# EAGLE design CrackberryPi_1.0.6.2_random (EAGLE 7.2.0)
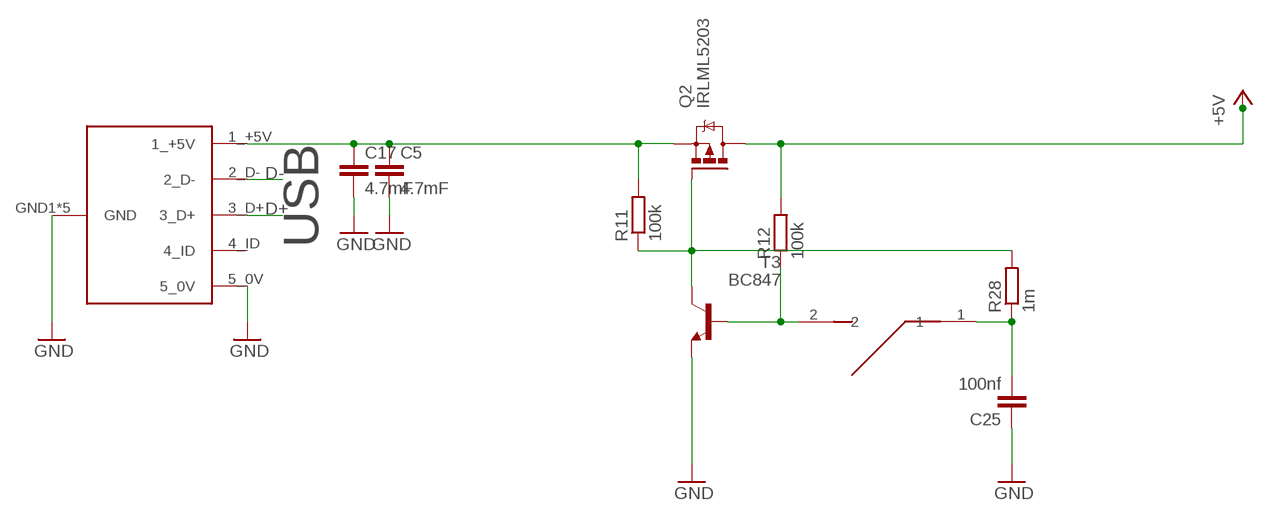
[diagram p0: schematic, sheet 1, part 1 of 2]
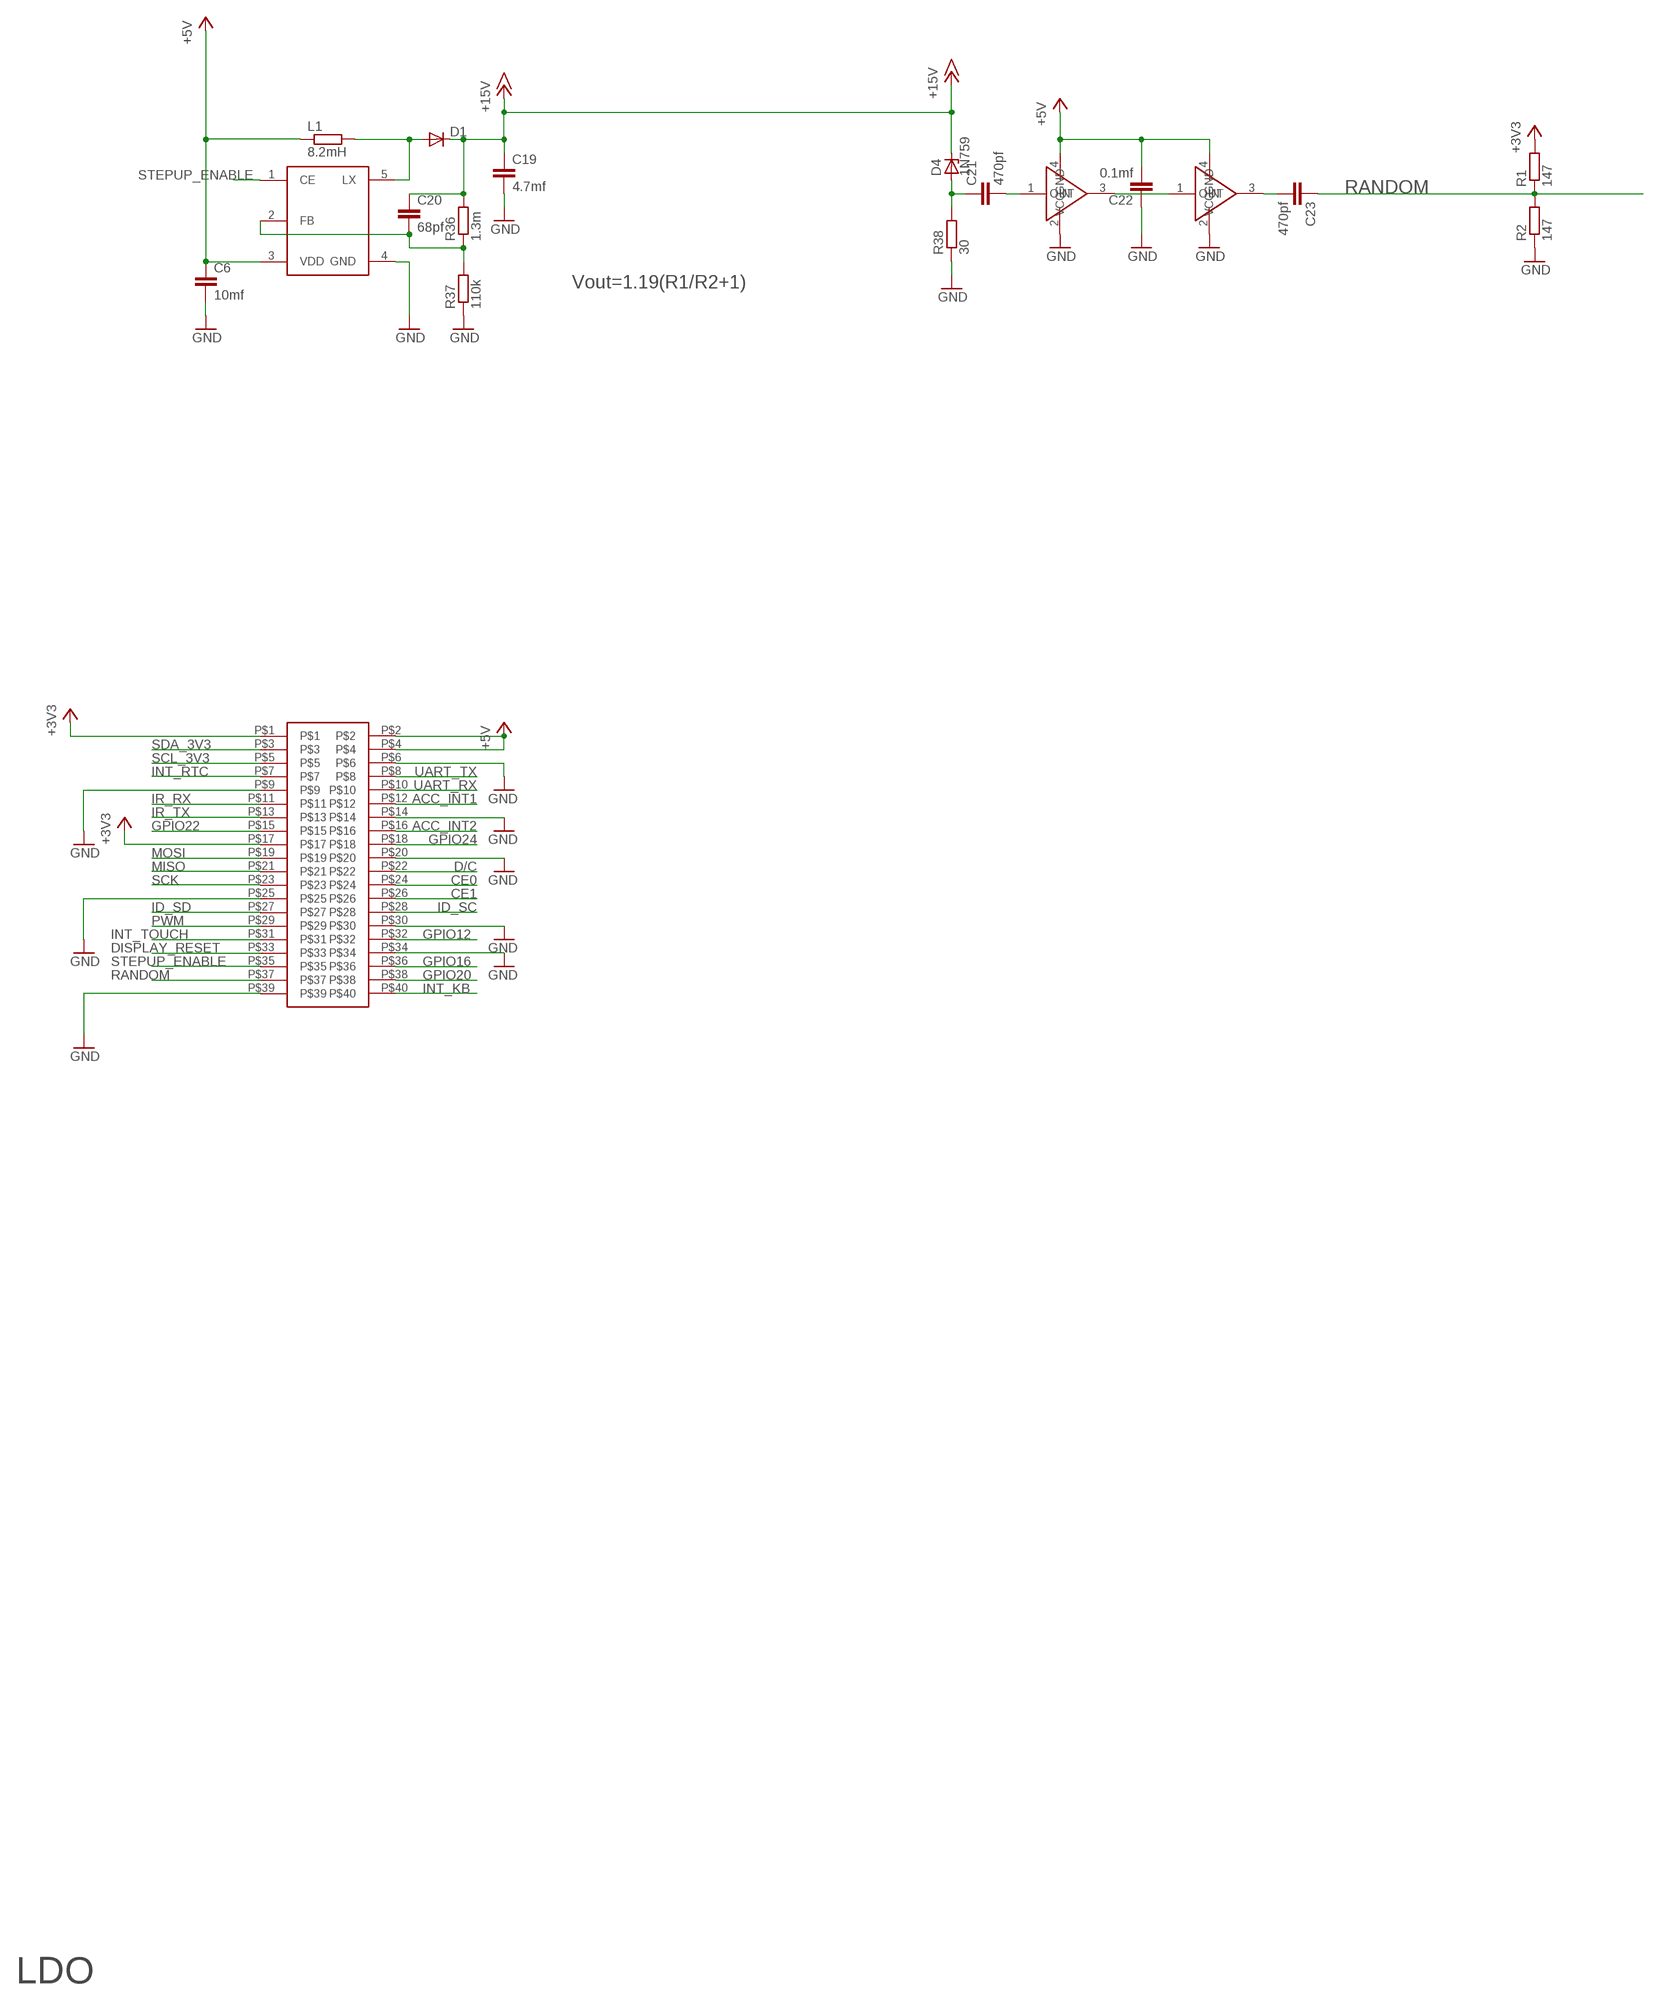
[diagram p1: schematic, sheet 1, part 2 of 2]

## Parts
C5  4.7mF  C-EUC0603  [C0603]
C6  10mf  C-EUC0603  [C0603]
C17  4.7mF  C-EUC0603  [C0603]
C19  4.7mf  C-EUC0603  [C0603]
C20  68pf  C-EUC0603  [C0603]
C21  470pf  C-EUC0603  [C0603]
C22  0.1mf  C-EUC0603  [C0603]
C23  470pf  C-EUC0603  [C0603]
C25  100nf  C-EUC0603  [C0603]
D1  DIODE-SOD123  [SOD123]
D4  1N759  ZENER-DIODESOD80C  [SOD80C]
L1  8.2mH  R-EU_R1210  [R1210]
Q2  IRLML5203  [MICRO3]
R1  147  R-EU_R0603  [R0603]
R2  147  R-EU_R0603  [R0603]
R11  100k  R-EU_R0603  [R0603]
R12  100k  R-EU_R0603  [R0603]
R28  1m  R-EU_R0603  [R0603]
R36  1.3m  R-EU_R0603  [R0603]
R37  110k  R-EU_R0603  [R0603]
R38  30  R-EU_R0603  [R0603]
T3  BC847  [SOT23]
U$2  NCP1406  [SOT23-5L]
U$3  MAX2650  [SOT143-W]
U$8  MOMSWITCH  [MOMSWITCH]
U$9  MICRO_USB  [MICRO_USB]
U$10  MAX2650  [SOT143-W]
U$11  HEADER  [20X2]

## Nets
+3V3: R1.2 U$11.P$1 U$11.P$17
+5V: C6.1 C22.2 L1.1 Q2.3(D) R12.2 U$2.3(VDD) U$3.4(VCC) U$10.4(VCC) U$11.P$2 U$11.P$4
+15V: C19.1 C20.1 D1.C D4.C R36.2
ACC_INT1: U$11.P$12
ACC_INT2: U$11.P$16
CE0: U$11.P$24
CE1: U$11.P$26
D+: U$9.3_D+
D-: U$9.2_D-
D/C: U$11.P$22
DISPLAY_RESET: U$11.P$33
FB: C20.2 R36.1 R37.2 U$2.2(FB)
GATE: Q2.1(G) R11.1 R28.2 T3.3(C)
GND: C5.2 C6.2 C17.2 C19.2 C22.1 C25.1 R2.1 R37.1 R38.1 T3.2(E) U$2.4(GND) U$3.2(GND) U$9.5_0V U$9.GND1(GND) U$9.GND2(GND) U$9.GND5(GND) U$9.P$1(GND) U$9.P$7(GND) U$10.2(GND) U$11.P$6 U$11.P$9 U$11.P$14 U$11.P$20 U$11.P$25 U$11.P$30 U$11.P$34 U$11.P$39
GPIO12: U$11.P$32
GPIO16: U$11.P$36
GPIO20: U$11.P$38
GPIO22: U$11.P$15
GPIO24: U$11.P$18
ID_SC: U$11.P$28
ID_SD: U$11.P$27
IN_1: C21.2 U$3.1(IN)
INT_KB: U$11.P$40
INT_RTC: U$11.P$7
INT_TOUCH: U$11.P$31
IR_RX: U$11.P$11
IR_TX: U$11.P$13
LX: D1.A L1.2 U$2.5(LX)
MISO: U$11.P$21
MOSI: U$11.P$19
N$1: C5.1 C17.1 Q2.2(S) R11.2 U$9.1_+5V
N$16: C21.1 D4.A R38.2
N$17: R12.1 T3.1(B) U$8.2
N$24: C25.2 R28.1 U$8.1
OUT1_IN2: U$3.3(OUT) U$10.1(IN)
OUT2: C23.2 U$10.3(OUT)
PWM: U$11.P$29
RANDOM: C23.1 R1.1 R2.2 U$11.P$37
SCK: U$11.P$23
SCL_3V3: U$11.P$5
SDA_3V3: U$11.P$3
STEPUP_ENABLE: U$2.1(CE) U$11.P$35
UART_RX: U$11.P$10
UART_TX: U$11.P$8
Unconnected: U$9.4_ID

## Notes on the sheet
- Vout=1.19(R1/R2+1)
- LDO
- USB

## Library data of the parts
C5 C6 C17 C19-C23 C25 = rcl:C-EU: CAPACITOR, European symbol
D1 = diode:DIODE-: DIODE
D4 = diode:ZENER-DIODE: Z-Diode
L1 R1 R2 R11 R12 R28 R36-R38 = rcl:R-EU_: RESISTOR, European symbol
Q2 = transistor-power:IRLML5203: HEXFET P-Channel Power MOSFET
T3 = transistor:BC847: NPN TRANSISTOR
U$2 = ncp1406:NCP1406
U$3 U$10 = max2650:MAX2650
U$8 = momswitch:MOMSWITCH
U$9 = MICRO_USB:MICRO_USB
U$11 = 20x2_cirqoid:HEADER

## Board
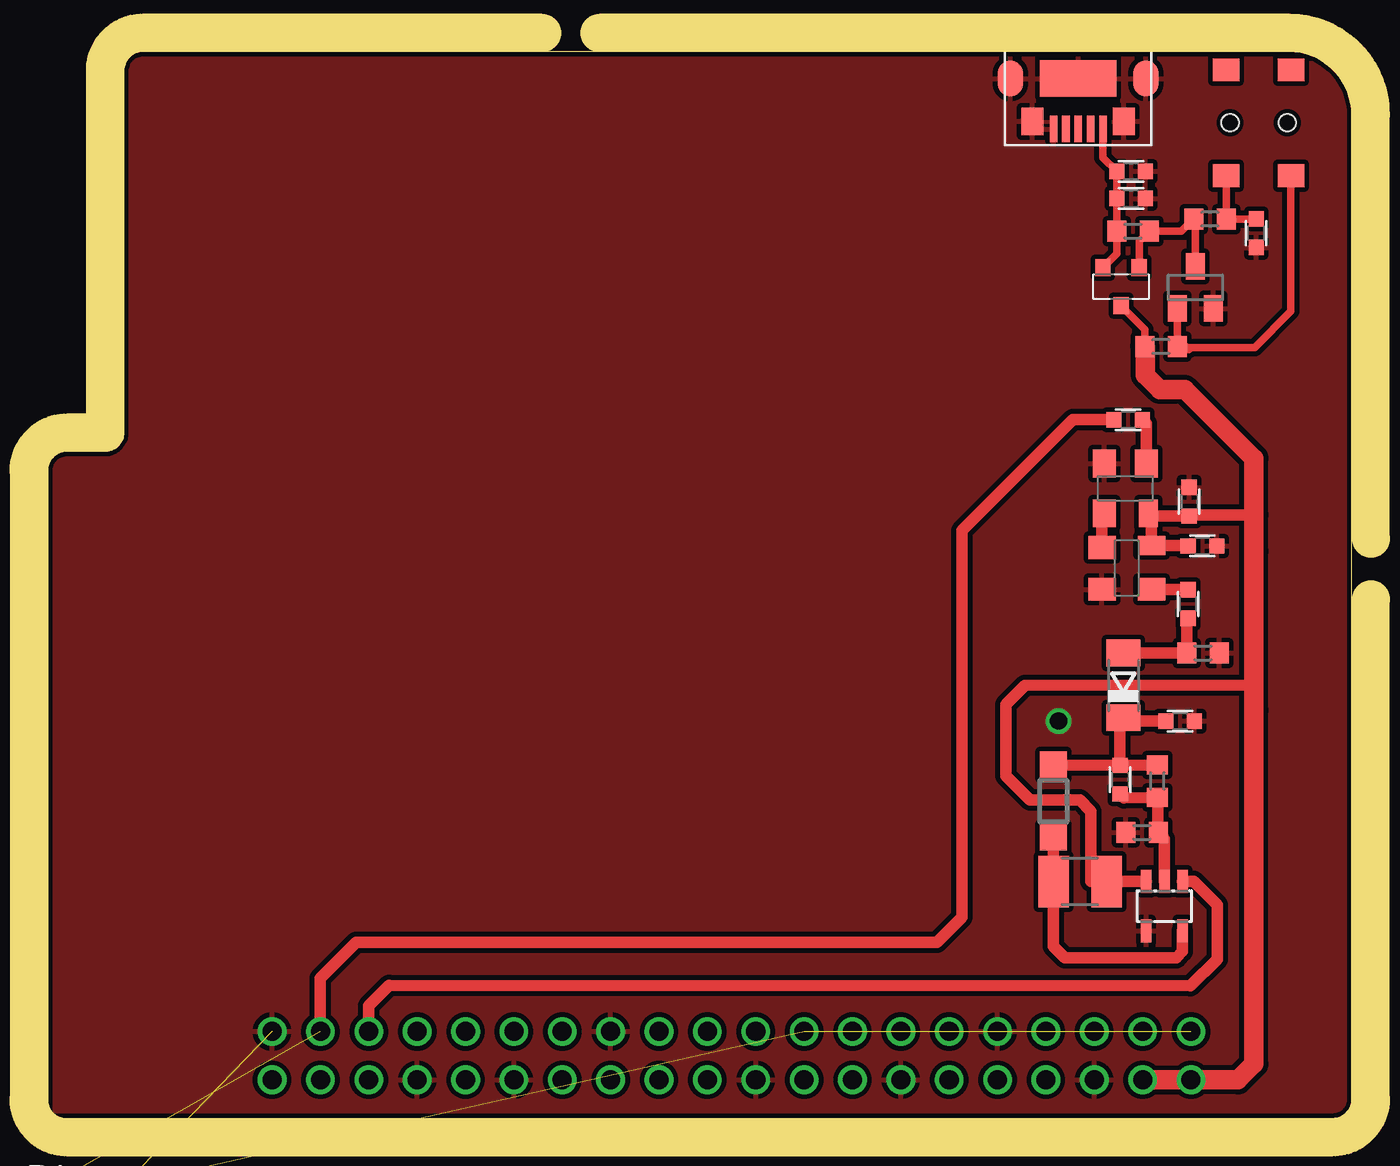
[diagram p2: board, top side]
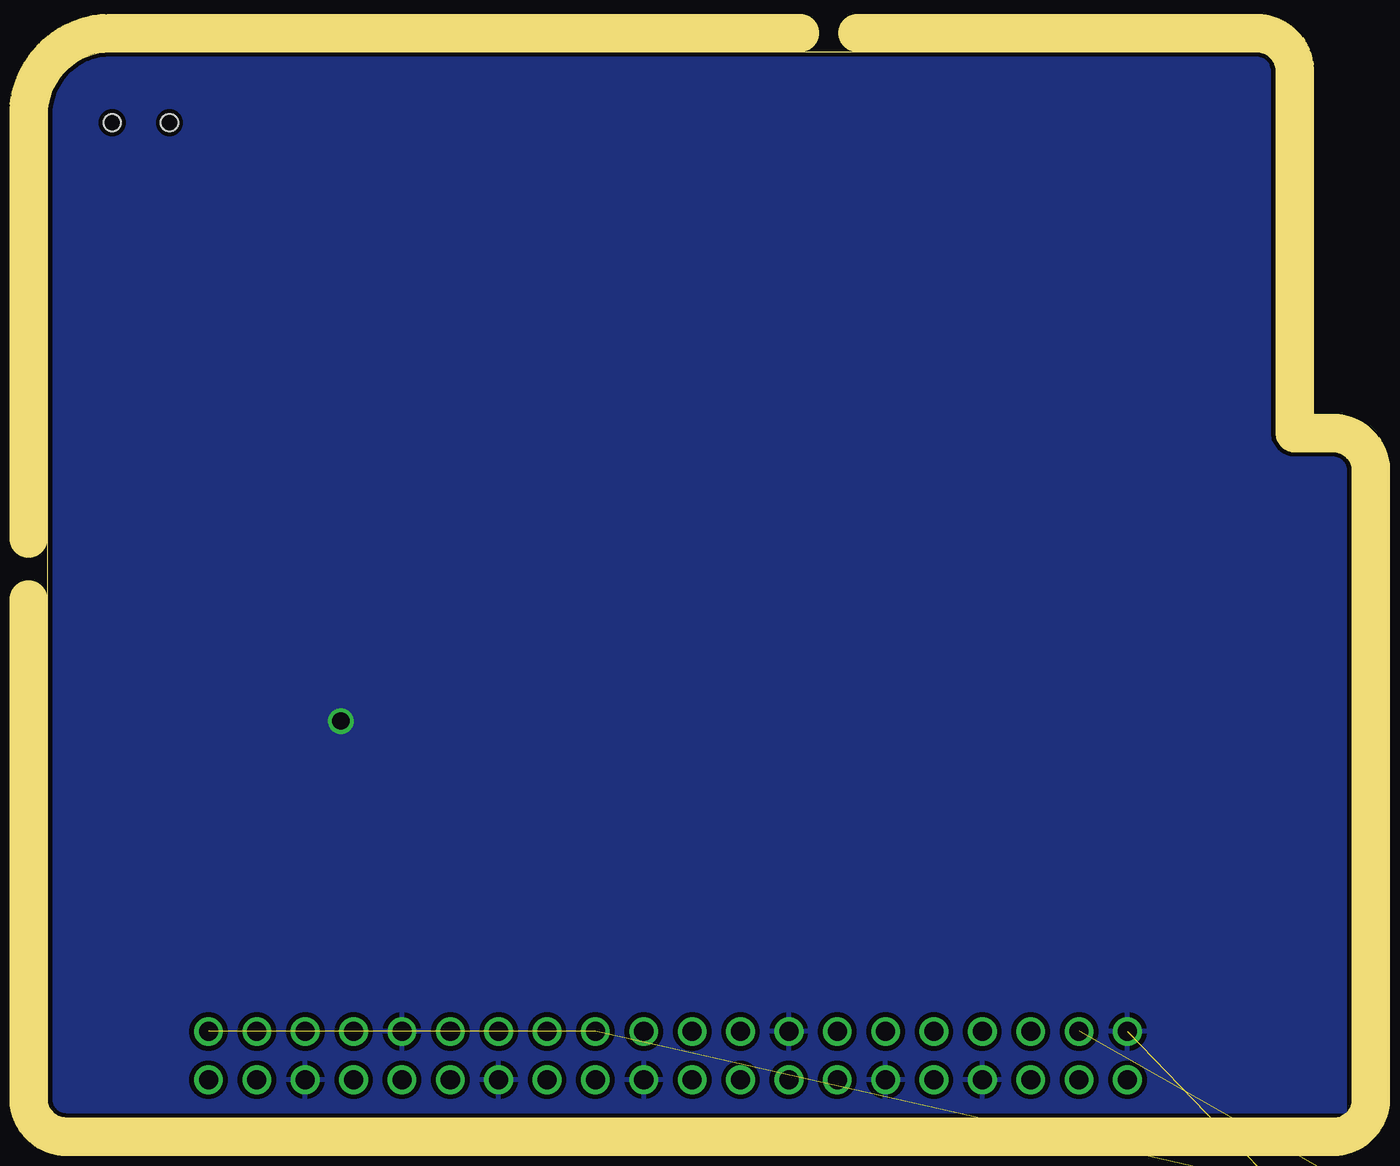
[diagram p3: board, bottom side, seen from below]

Size 68.5 x 56 mm. Coordinates in mm from the lower left corner, seen from the top.
Outline: 0,34 0,0 67.5,0 arc90 68.5,1 68.5,52.7 arc90 65.2,56 5,56 arc90 4,55 4,36 arc-90 3,35 1,35 arc90 0,34
Copper layers (1*16): Top 0.035mm / dielectric 1.5mm / Bottom 0.035mm
Design rules "SeeedStudio_2layer_DRU_no_angle_20140221": minimum track width 6mil, minimum drill 12mil, track to track 6mil, track to pad 6mil, pad to pad 6mil, via to via 6mil, smd to smd 0mil, copper to edge 10mil, drill to drill 10mil, minimum pad ring 10mil, minimum via ring 6mil, stop-mask expansion 2mil, vias tented up to drill 100mil, thermal gap 10mil
tRestrict: area 52.3,52.7 to 55.9,53.6
Milling: 13 lines

### Footprints (pad centres in the part's own frame; a part is rotated, then mirrored left to right if it is on the bottom)
C0603 = smd 0.8 x 0.8: 1 -0.75,0; 2 0.75,0
SOD123 = smd 1.4 x 1.4: A 1.9,0; C -1.9,0
SOD80C = smd 1.4 x 1.8: A 1.7,0; C -1.7,0
R1210 = smd 1.6 x 2.7: 1 -1.4,0; 2 1.4,0
MICRO3 = smd 0.8 x 0.9: 1 -0.95,-1; 2 0.95,-1; 3 0,1
R0603 = smd 1 x 1.1: 1 -0.85,0; 2 0.85,0
SOT23 = smd 1 x 1.4: 1 -0.95,-1.1; 2 0.95,-1.1; 3 0,1.1
SOT23-5L = smd 0.55 x 1.2: 1 -0.95,-1.3; 2 0,-1.3; 3 0.95,-1.3; 4 0.95,1.3; 5 -0.95,1.3
SOT143-W = smd 1.2 x 1.45: 1 -1.1,-1.3; 2 -1.1,1.3; 3 1.1,1.3 | smd 1 x 1.45: 4 1.2,-1.3
MOMSWITCH = smd 1.4 x 1.2: 1 -1.7,-2.775; 2 1.7,-2.775; P$1 -1.7,2.775; P$2 1.7,2.775 | hole 0.9: 1.5,0; -1.5,0
MICRO_USB = smd 0.4 x 1.4: 1_+5V -1.3,2.65; 2_D- -0.65,2.65; 3_D+ 0,2.65; 4_ID 0.65,2.65; 5_0V 1.3,2.65 | smd 4 x 1.9: GND1 0,0 | smd 1.35 x 1.9: GND2 -3.55,0; GND5 3.55,0 | smd 1.15 x 1.45: P$1 -2.4,2.25; P$7 2.4,2.25
20X2 = drill 1: P$1 0,0; P$2 0,2.54; P$3 2.54,0; P$4 2.54,2.54; P$5 5.08,0; P$6 5.08,2.54; P$7 7.62,0; P$8 7.62,2.54; P$9 10.16,0; P$10 10.16,2.54; P$11 12.7,0; P$12 12.7,2.54; P$13 15.24,0; P$14 15.24,2.54; P$15 17.78,0; P$16 17.78,2.54; P$17 20.32,0; P$18 20.32,2.54; P$19 22.86,0; P$20 22.86,2.54; P$21 25.4,0; P$22 25.4,2.54; P$23 27.94,0; P$24 27.94,2.54; P$25 30.48,0; P$26 30.48,2.54; P$27 33.02,0; P$28 33.02,2.54; P$29 35.56,0; P$30 35.56,2.54; P$31 38.1,0; P$32 38.1,2.54; P$33 40.64,0; P$34 40.64,2.54; P$35 43.18,0; P$36 43.18,2.54; P$37 45.72,0; P$38 45.72,2.54; P$39 48.26,0; P$40 48.26,2.54

### Placement (x,y rotation side)
C5  56.9,49.73 0 top
C6  60.65,30.05 0 top
C17  56.9,48.3 0 top
C19  59.48,20.85 0 top
C20  56.33,17.77 270 top
C21  59.9,27 90 top
C22  59.95,32.38 270 top
C23  56.75,36.67 0 top
C25  63.48,46.48 90 top
D1  52.83,16.65 270 top
D4  56.5,22.73 90 top
L1  54.23,12.43 180 top
Q2  56.38,43.67 180 top
R1  -0.5,-4.35 0 top  (outside the outline)
R2  -0.5,-9.1 0 top  (outside the outline)
R11  57,46.58 180 top
R12  58.48,40.52 180 top
R28  61.05,47.23 180 top
R36  58.27,17.7 90 top
R37  57.48,15 0 top
R38  60.67,24.43 180 top
T3  60.27,43.62 0 top
U$2  58.65,11.12 180 top
U$3  56.67,28.88 90 top
U$8  63.6,52.27 0 top
U$9  54.12,54.6 180 top
U$10  56.6,33.08 0 top
U$11  60.05,4.55 180 top

### Tracks (layer width: path | path; a pad name or v marks a point on that pad's centre or on a via)
+3V3  (2 unrouted)
+5V
  Top 0.406: R12.2 57.62,41.42 Q2.3
  Top 0.61: L1.1 U$2.3 54.8,12.43 54.8,16.1 54.2,16.7 51.6,16.7 50.33,17.98 50.33,21.73 51.33,22.73 63.35,22.75 63.35,21.43 | 57.98,31.62 U$3.4 59.88,30.07 C6.1 | 57.98,31.62 U$10.4 | 63.35,29.75 63.35,29.77 | 57.98,31.62 C22.2 59.73,31.68 63.35,31.68
  Top 1.016: U$11.P$4 U$11.P$2 62.51,2.01 63.35,2.85 63.35,21.43 63.35,29.77 63.35,31.68 63.35,34.65 59.73,38.27 58.4,38.27 57.65,39.02 57.65,40.5 R12.2
+15V
  Top 0.61: D1.C C20.1 | C20.1 R36.2 | 56.33,20.85 C20.1 | 56.33,20.85 D4.C | 56.33,20.85 C19.1
FB
  Top 0.61: C20.2 56.52,16.82 R36.1 R37.2 58.65,14.68 U$2.2
GATE
  Top 0.406: Q2.1 57.33,46.05 R11.1 59.55,46.58 R28.2 60.27,47.15 T3.3
GND  (via drill 0.9)  (1 unrouted)
  other vias: 53.1,20.85
  pour Top (isolate 0.254, rank 6): 0,34 0,1 arc90 1,0 67.5,0 arc90 68.62,1.13 68.62,52.83 arc90 65.1,56 5,56 arc90 4,55 4,36 arc-90 3,35 1,35 arc90
  pour Bottom (isolate 0.254): 0,34.95 0,1 arc90 1,0 67.5,0 arc90 68.53,1.03 68.53,52.82 arc90 65.4,55.95 4.03,55.95 4.03,34.95
IN_1
  Top 0.61: U$3.1 58,27.75 C21.2
LX
  Top 0.61: D1.A L1.2 52.83,9.03 53.42,8.43 59.27,8.43 59.6,8.75 U$2.5
N$1
  Top 0.406: U$9.1_+5V 55.42,50.45 C5.1 C17.1 R11.2 56.15,45.4 Q2.2
N$16
  Top 0.61: D4.A R38.2 59.83,26.18 C21.1
N$17
  Top 0.406: R12.1 59.5,40.35 59.92,40.35 59.33,40.95 T3.1 59.33,40.48 63.4,40.48 65.3,42.38 U$8.2
N$24
  Top 0.406: C25.2 R28.1 U$8.1
OUT1_IN2
  Top 0.61: U$10.1 55.38,31.77 U$3.3
OUT2
  Top 0.61: C23.2 57.7,36.48 U$10.3
RANDOM  (2 unrouted)
  Top 0.61: U$11.P$37 14.32,7.35 16.2,9.22 46.7,9.22 48.02,10.55 48.02,30.85 53.85,36.67 C23.1
STEPUP_ENABLE
  Top 0.61: U$11.P$35 16.87,5.9 17.95,6.97 60.02,6.95 61.42,8.35 61.42,11.2 60.2,12.43 U$2.1